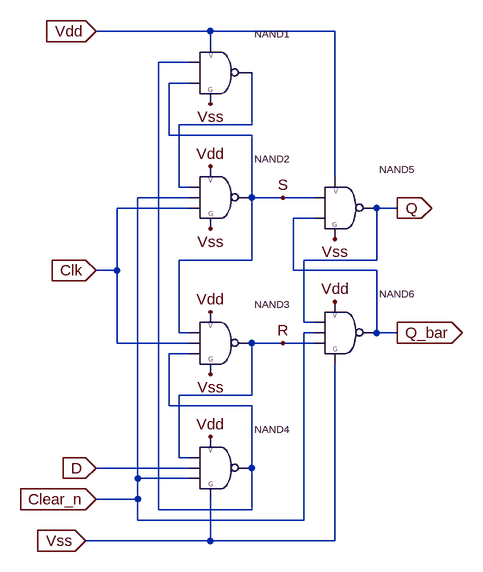
[diagram p0: schematic D_FF.asc]
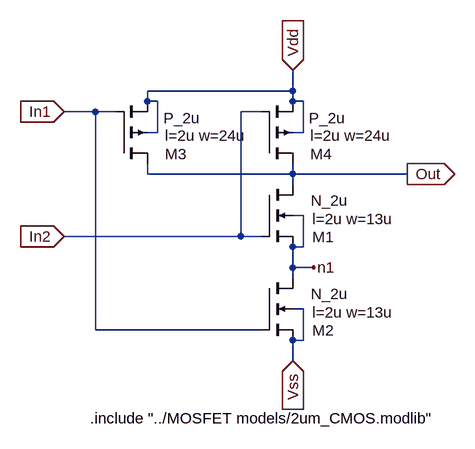
[diagram p1: sub-circuit nand2.asc]
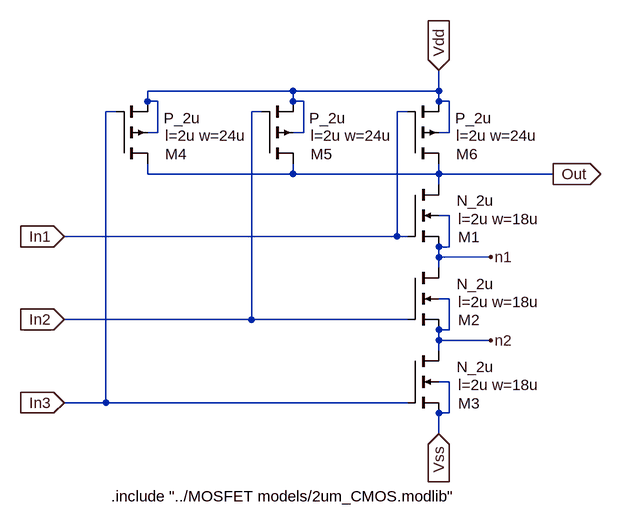
[diagram p2: sub-circuit nand3.asc]
D_FF.asc, the LTspice schematic file:
Version 4
SHEET 1 904 680
WIRE 288 -176 112 -176
WIRE 480 -176 288 -176
WIRE 288 -160 288 -176
WIRE 256 -128 208 -128
WIRE 256 -96 224 -96
WIRE 352 -32 352 -112
WIRE 352 -32 240 -32
WIRE 224 -16 224 -96
WIRE 352 -16 224 -16
WIRE 480 48 480 -176
WIRE 240 64 240 -32
WIRE 256 64 240 64
WIRE 256 80 176 80
WIRE 352 80 352 -16
WIRE 400 80 352 80
WIRE 448 80 400 80
WIRE 256 96 144 96
WIRE 576 96 544 96
WIRE 448 112 416 112
WIRE 352 176 352 80
WIRE 352 176 240 176
WIRE 544 176 544 96
WIRE 544 176 432 176
WIRE 144 192 144 96
WIRE 144 192 112 192
WIRE 416 192 416 112
WIRE 544 192 416 192
WIRE 432 272 432 176
WIRE 448 272 432 272
WIRE 240 288 240 176
WIRE 256 288 240 288
WIRE 448 288 432 288
WIRE 544 288 544 192
WIRE 576 288 544 288
WIRE 144 304 144 192
WIRE 256 304 144 304
WIRE 400 304 352 304
WIRE 448 304 400 304
WIRE 256 320 224 320
WIRE 352 384 352 304
WIRE 352 384 240 384
WIRE 224 400 224 320
WIRE 352 400 224 400
WIRE 240 480 240 384
WIRE 256 480 240 480
WIRE 256 496 112 496
WIRE 352 496 352 400
WIRE 176 512 176 80
WIRE 256 512 176 512
WIRE 176 544 176 512
WIRE 176 544 112 544
WIRE 208 560 208 -128
WIRE 352 560 352 496
WIRE 352 560 208 560
WIRE 176 576 176 544
WIRE 432 576 432 288
WIRE 432 576 176 576
WIRE 288 608 288 544
WIRE 288 608 96 608
WIRE 480 608 480 336
WIRE 480 608 288 608
FLAG 112 496 D
IOPIN 112 496 In
FLAG 112 192 Clk
IOPIN 112 192 In
FLAG 112 -176 Vdd
IOPIN 112 -176 In
FLAG 96 608 Vss
IOPIN 96 608 In
FLAG 576 96 Q
IOPIN 576 96 Out
FLAG 576 288 Q_bar
IOPIN 576 288 Out
FLAG 400 80 S
FLAG 400 304 R
FLAG 112 544 Clear_n
IOPIN 112 544 In
FLAG 288 32 Vdd
FLAG 288 256 Vdd
FLAG 480 240 Vdd
FLAG 288 448 Vdd
FLAG 288 -64 Vss
FLAG 288 128 Vss
FLAG 480 144 Vss
FLAG 288 352 Vss
SYMBOL NAND2 464 96 R0
SYMATTR InstName NAND5
SYMBOL NAND2 272 -112 R0
SYMATTR InstName NAND1
SYMBOL NAND3 272 496 R0
SYMATTR InstName NAND4
SYMBOL NAND3 272 304 R0
SYMATTR InstName NAND3
SYMBOL NAND3 272 80 R0
SYMATTR InstName NAND2
SYMBOL NAND3 464 288 R0
SYMATTR InstName NAND6

nand2.asc, the sub-circuit schematic file:
Version 4
SHEET 1 880 680
WIRE 192 48 192 16
WIRE 192 48 -32 48
WIRE -32 64 -32 48
WIRE -16 64 -32 64
WIRE 192 64 192 48
WIRE 208 64 192 64
WIRE -112 80 -160 80
WIRE -80 80 -112 80
WIRE 144 80 112 80
WIRE -16 112 -16 64
WIRE -16 112 -32 112
WIRE 208 112 208 64
WIRE 208 112 192 112
WIRE -32 176 -32 160
WIRE 192 176 192 160
WIRE 192 176 -32 176
WIRE 368 176 192 176
WIRE 192 192 192 176
WIRE 208 240 192 240
WIRE 112 272 112 80
WIRE 112 272 -160 272
WIRE 144 272 112 272
WIRE 208 288 208 240
WIRE 208 288 192 288
WIRE 192 320 192 288
WIRE 224 320 192 320
WIRE 192 336 192 320
WIRE 208 384 192 384
WIRE -112 416 -112 80
WIRE 144 416 -112 416
WIRE 208 432 208 384
WIRE 208 432 192 432
WIRE 192 464 192 432
FLAG 192 16 Vdd
IOPIN 192 16 In
FLAG 192 464 Vss
IOPIN 192 464 In
FLAG -160 80 In1
IOPIN -160 80 In
FLAG -160 272 In2
IOPIN -160 272 In
FLAG 368 176 Out
IOPIN 368 176 Out
FLAG 224 320 n1
SYMBOL nmos4 144 192 R0
WINDOW 0 78 81 Left 2
WINDOW 3 76 25 Left 2
WINDOW 123 78 53 Left 2
SYMATTR InstName M1
SYMATTR Value N_2u
SYMATTR Value2 l=2u w=13u
SYMBOL pmos4 144 160 M180
WINDOW 0 75 15 Left 2
WINDOW 3 73 70 Left 2
WINDOW 123 75 43 Left 2
SYMATTR InstName M4
SYMATTR Value P_2u
SYMATTR Value2 l=2u w=24u
SYMBOL pmos4 -80 160 M180
WINDOW 0 75 15 Left 2
WINDOW 3 73 70 Left 2
WINDOW 123 75 43 Left 2
SYMATTR InstName M3
SYMATTR Value P_2u
SYMATTR Value2 l=2u w=24u
SYMBOL nmos4 144 336 R0
WINDOW 0 78 81 Left 2
WINDOW 3 76 25 Left 2
WINDOW 123 78 53 Left 2
SYMATTR InstName M2
SYMATTR Value N_2u
SYMATTR Value2 l=2u w=13u
TEXT -120 552 Left 2 !.include "../MOSFET models/2um_CMOS.modlib"

nand3.asc, the sub-circuit schematic file:
Version 4
SHEET 1 880 872
WIRE -32 48 -256 48
WIRE 192 48 192 16
WIRE 192 48 -32 48
WIRE -256 64 -256 48
WIRE -240 64 -256 64
WIRE -32 64 -32 48
WIRE -16 64 -32 64
WIRE 192 64 192 48
WIRE 208 64 192 64
WIRE -304 80 -320 80
WIRE -80 80 -96 80
WIRE 144 80 128 80
WIRE -240 112 -240 64
WIRE -240 112 -256 112
WIRE -16 112 -16 64
WIRE -16 112 -32 112
WIRE 208 112 208 64
WIRE 208 112 192 112
WIRE -256 176 -256 160
WIRE -32 176 -32 160
WIRE -32 176 -256 176
WIRE 192 176 192 160
WIRE 192 176 -32 176
WIRE 368 176 192 176
WIRE 192 192 192 176
WIRE 208 240 192 240
WIRE 128 272 128 80
WIRE 128 272 -384 272
WIRE 144 272 128 272
WIRE 208 288 208 240
WIRE 208 288 192 288
WIRE 192 304 192 288
WIRE 272 304 192 304
WIRE 192 320 192 304
WIRE 208 368 192 368
WIRE -96 400 -96 80
WIRE -96 400 -384 400
WIRE 144 400 -96 400
WIRE 208 416 208 368
WIRE 208 416 192 416
WIRE 192 432 192 416
WIRE 272 432 192 432
WIRE 192 448 192 432
WIRE 208 496 192 496
WIRE -320 528 -320 80
WIRE -320 528 -384 528
WIRE 144 528 -320 528
WIRE 208 544 208 496
WIRE 208 544 192 544
WIRE 192 576 192 544
FLAG 192 16 Vdd
IOPIN 192 16 In
FLAG 192 576 Vss
IOPIN 192 576 In
FLAG -384 272 In1
IOPIN -384 272 In
FLAG -384 400 In2
IOPIN -384 400 In
FLAG 368 176 Out
IOPIN 368 176 Out
FLAG -384 528 In3
IOPIN -384 528 In
FLAG 272 304 n1
FLAG 272 432 n2
SYMBOL nmos4 144 192 R0
WINDOW 0 78 81 Left 2
WINDOW 3 76 25 Left 2
WINDOW 123 78 53 Left 2
SYMATTR InstName M1
SYMATTR Value N_2u
SYMATTR Value2 l=2u w=18u
SYMBOL pmos4 144 160 M180
WINDOW 0 75 15 Left 2
WINDOW 3 73 70 Left 2
WINDOW 123 75 43 Left 2
SYMATTR InstName M6
SYMATTR Value P_2u
SYMATTR Value2 l=2u w=24u
SYMBOL pmos4 -80 160 M180
WINDOW 0 75 15 Left 2
WINDOW 3 73 70 Left 2
WINDOW 123 75 43 Left 2
SYMATTR InstName M5
SYMATTR Value P_2u
SYMATTR Value2 l=2u w=24u
SYMBOL nmos4 144 448 R0
WINDOW 0 78 81 Left 2
WINDOW 3 76 25 Left 2
WINDOW 123 78 53 Left 2
SYMATTR InstName M3
SYMATTR Value N_2u
SYMATTR Value2 l=2u w=18u
SYMBOL pmos4 -304 160 M180
WINDOW 0 75 15 Left 2
WINDOW 3 73 70 Left 2
WINDOW 123 75 43 Left 2
SYMATTR InstName M4
SYMATTR Value P_2u
SYMATTR Value2 l=2u w=24u
SYMBOL nmos4 144 320 R0
WINDOW 0 78 81 Left 2
WINDOW 3 76 25 Left 2
WINDOW 123 78 53 Left 2
SYMATTR InstName M2
SYMATTR Value N_2u
SYMATTR Value2 l=2u w=18u
TEXT -312 672 Left 2 !.include "../MOSFET models/2um_CMOS.modlib"

The netlist it stands for:
* D_FF.asc
XNAND5 S Q_bar Q Vdd Vss nand2
XNAND1 N001 S N002 Vdd Vss nand2
XNAND4 R Clear_n D N001 Vdd Vss nand3
XNAND3 S N001 Clk R Vdd Vss nand3
XNAND2 N002 Clk Clear_n S Vdd Vss nand3
XNAND6 Q R Clear_n Q_bar Vdd Vss nand3

* block symbol definitions
.subckt nand2 In1 In2 Out Vdd Vss
M1 Out In2 n1 n1 N_2u l=2u w=13u
M4 Out In2 Vdd Vdd P_2u l=2u w=24u
M3 Out In1 Vdd Vdd P_2u l=2u w=24u
M2 n1 In1 Vss Vss N_2u l=2u w=13u
.include "../MOSFET models/2um_CMOS.modlib"
.ends nand2

.subckt nand3 In1 In2 In3 Out Vdd Vss
M1 Out In1 n1 n1 N_2u l=2u w=18u
M6 Out In1 Vdd Vdd P_2u l=2u w=24u
M5 Out In2 Vdd Vdd P_2u l=2u w=24u
M3 n2 In3 Vss Vss N_2u l=2u w=18u
M4 Out In3 Vdd Vdd P_2u l=2u w=24u
M2 n1 In2 n2 n2 N_2u l=2u w=18u
.include "../MOSFET models/2um_CMOS.modlib"
.ends nand3

.model NMOS NMOS
.model PMOS PMOS
.lib standard.mos
.backanno
.end